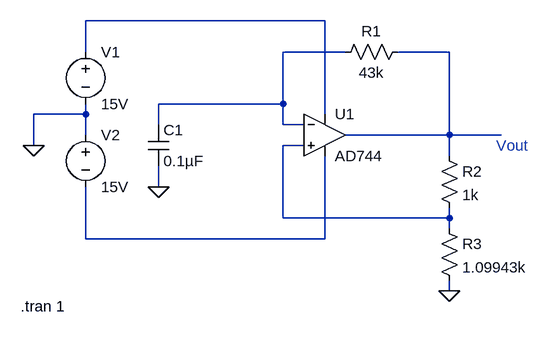
[diagram p0: schematic Draft1.asc]
Draft1.asc, the LTspice schematic file:
Version 4
SHEET 1 1112 680
WIRE 288 -32 -80 -32
WIRE -80 16 -80 -32
WIRE 320 16 224 16
WIRE 480 16 400 16
WIRE 224 96 224 16
WIRE 224 96 32 96
WIRE -80 112 -80 96
WIRE -80 112 -160 112
WIRE 288 112 288 -32
WIRE 32 128 32 96
WIRE 224 128 224 96
WIRE 256 128 224 128
WIRE -80 144 -80 112
WIRE 480 144 480 16
WIRE 480 144 320 144
WIRE 560 144 480 144
WIRE -160 160 -160 112
WIRE 256 160 224 160
WIRE 480 176 480 144
WIRE 32 224 32 192
WIRE 224 272 224 160
WIRE 480 272 480 256
WIRE 480 272 224 272
WIRE 480 288 480 272
WIRE -80 304 -80 224
WIRE 288 304 288 176
WIRE 288 304 -80 304
WIRE 480 384 480 368
FLAG 480 384 0
FLAG 32 224 0
FLAG -160 160 0
SYMBOL res 464 160 R0
SYMATTR InstName R2
SYMATTR Value 1k
SYMBOL res 464 272 R0
SYMATTR InstName R3
SYMATTR Value 1.09943k
SYMBOL res 416 0 R90
WINDOW 0 0 56 VBottom 2
WINDOW 3 32 56 VTop 2
SYMATTR InstName R1
SYMATTR Value 43k
SYMBOL cap 16 128 R0
SYMATTR InstName C1
SYMATTR Value 0.1µF
SYMBOL voltage -80 0 R0
SYMATTR InstName V1
SYMATTR Value 15V
SYMBOL voltage -80 128 R0
SYMATTR InstName V2
SYMATTR Value 15V
SYMBOL Opamps\\AD744 288 80 R0
SYMATTR InstName U1
TEXT -180 408 Left 2 !.tran 1
TEXT 552 160 Left 2 ;Vout

The netlist it stands for:
* Draft1.asc
R2 N003 N004 1k
R3 N004 0 1.09943k
R1 N003 N002 43k
C1 N002 0 0.1µF
V1 N001 0 15V
V2 0 N005 15V
XU1 N004 N002 N001 N005 N003 AD744  ; pins In+ In- V+ V- OUT
.tran 1
* Vout
.backanno
.end